# EasyEDA Pro project LM2596S_V1.0.eprj

# Board 1-PCB_降压LM2596S.PcbDoc
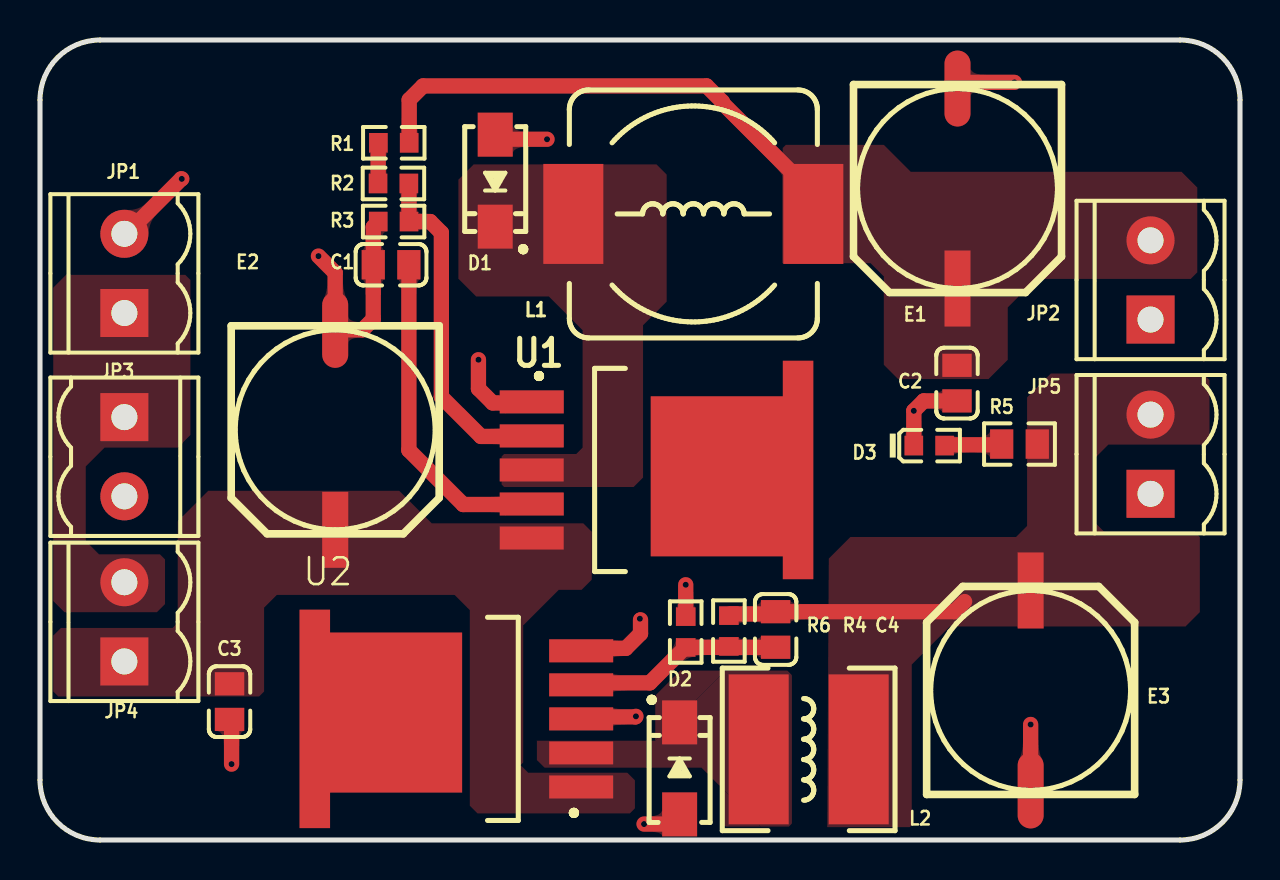
[diagram p0: board, top side]
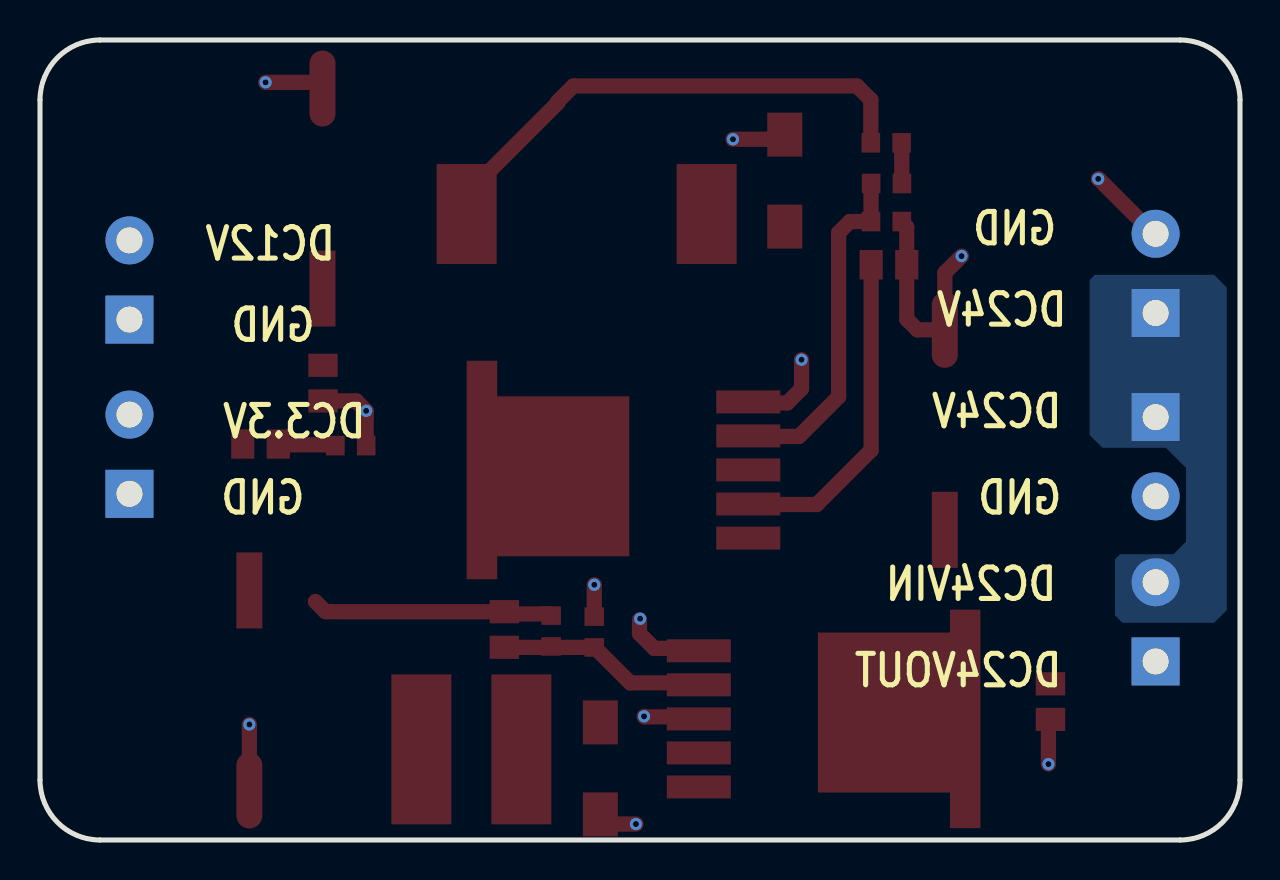
[diagram p1: board, bottom side, seen from below]

Outline 60 x 40 mm; copper layers: Top Layer, Bottom Layer. Coordinates in mm from the lower left corner of the outline.
Outline path: 0,37 arc(0.88,39.12) 3,40 57,40 arc(59.12,39.12) 60,37 60,3 arc(59.12,0.88) 57,0 3,0 arc(0.88,0.88) 0,3 0,37
Stack: Top Layer 0.035mm / Dielectric1 1.51mm FR4 er 4.5 / Bottom Layer 0.035mm

## Design rules (mm)
spacing Default (default): track to track 0.152, other pairs 0 to 0.152
track width Default (default): min 0.152, default 0.152, max 25.4
differential pair differentialPair (default): width min 0.127, default 0.254, max 2.54; gap min 0.152, default 0.152
via Default (default): diameter min 0.61, default 0.61, max 100.025; hole min 0.305, default 0.305, max 59.995
net GND uses (1)

## Placement (name value [footprint] x y rotation side)
C1  1uF (105) 10% 50V  [0805_C]  17.55 28.76 0 top
C2  100nF(104) 10% 50V  [0805_C]  45.85 22.84 270 top
C3  100nF(104) 10% 50V  [0805_C]  9.48 6.92 270 top
C4  100nF(104) 10% 50V  [0805_C]  36.78 10.53 270 top
D1  SS54  [SMA]  22.76 32.97 270 top
D2  SS54  [SMA]  31.98 3.58 90 top
D3  红灯 0603  [0603_LED_S1]  44.46 19.72 0 top
E1  220UF/16V  [CT 10*8 - V]  45.88 32.57 270 top
E2  220UF/16V  [CT 10*8 - V]  14.76 20.51 270 top
E3  220UF/16V  [CT 10*8 - V]  49.53 7.48 90 top
JP1  HDR-1X2  [HT3.96-LI-2P]  4.22 28.33 90 top
JP2  HDR-1X2  [HT3.96-LI-2P]  55.53 28 90 top
JP3  HDR-1X2  [HT3.96-LI-2P]  4.22 19.16 270 top
JP4  HDR-1X2  [HT3.96-LI-2P]  4.22 10.91 90 top
JP5  HDR-1X2  [HT3.96-LI-2P]  55.53 19.29 90 top
L1  47UH  [CDRH129]  32.67 31.3 0 top
L2  33UH  [CD73]  38.43 4.53 0 top
R1  90KΩ  [0603_R]  17.69 34.86 0 top
R2  0Ω (0R0) ±1%  [0603_R]  17.67 32.83 180 top
R3  10KΩ (1002) ±1%  [0603_R]  17.68 30.92 0 top
R4  18KΩ (1802) ±1%  [0603_R]  34.44 10.45 90 top
R5  10KΩ (1002) ±1%  [0805_R]  48.97 19.8 0 top
R6  10KΩ (1002) ±1%  [0603_R]  32.29 10.4 270 top
U1  XL4015E1  [TO-263-5_L10.2-W8.9-P1.70-TL]  29.59 18.5 0 top
U2  LM2596S-ADJ  [TO-263-5_L10.2-W8.9-P1.70-TL]  22.05 6.06 180 top

## Footprints (pads in the part's own frame, mm; a bottom-side part is the same pattern mirrored in y, then rotated)
0603_LED_S1
  rect 0.93x0.98 smd: A(0.77,0) K(-0.77,0)
0603_R
  rect 0.93x0.98 smd: 1(-0.77,0) 2(0.77,0)
0805_C
  rect 1.16x1.47 smd: 1(-0.89,0) 2(0.89,0)
0805_R
  rect 1.16x1.47 smd: 1(-0.89,0) 2(0.89,0)
CD73
  rect 3x7.5 smd: 1(-2.5,0) 2(2.5,0)
CDRH129
  rect 3x5 smd: 1(-6,0) 2(6,0)
CT 10*8 - V
  rect 3.8x1.3 smd: 1(5,0)
  oval 3.8x1.3 smd: 2(-5,0)
HT3.96-LI-2P
  rect 2.4x2.4 hole 1.3: 1(-1.98,0)
  round 2.4 hole 1.3: 2(1.98,0)
SMA
  rect 2.2x1.75 smd: 1(-2.3,0) 2(2.3,0)
TO-263-5_L10.2-W8.9-P1.70-TL
  rect 3.2x1.15 smd: 1(-5.008,3.404) 2(-5.008,1.702) 3(-5.008,0) 4(-5.008,-1.702) 5(-5.008,-3.404)

## Nets
GND: C1.1 C2.2 C3.2 D1.1 D2.1 D3.K E1.2 E2.2 E3.2 JP1.2 JP2.1 JP3.2 JP5.1 R3.1 R6.1 U1.1 U2.3 U2.5
FB: R2.1 R3.2 U1.2
NETC1_2: C1.2 U1.4
NETC2_1: C2.1 E1.1 JP2.2 L1.2 R1.2
NETC3_1: C3.1 E2.1 JP4.1 U1.5 U2.1
NETC4_1: C4.1 E3.1 JP5.2 L2.2 R4.2 R5.2
NETC4_2: C4.2 R4.1 R6.2 U2.4
NETD1_2: D1.2 L1.1 U1.3
NETD2_2: D2.2 L2.1 U2.2
NETD3_A: D3.A R5.1
NETJP1_1: JP1.1 JP3.1 JP4.2
NETR1_1: R1.1 R2.2

## Via types
v1: diameter 0.61, hole 0.305, Top Layer to Bottom Layer, 12 vias

## Routing (per net, layer and track width the routed paths; a pad name or vN(x,y) marks a point on that pad's centre or on a via; arc(x,y) is an arc through that point)
GND: length 46.2
  Top Layer w0.762: D1.1 22.99,35.04 v1(25.35,35.04) ; C2.2 44.19,21.95 v1(43.69,21.46) D3.K ; 26.7,6.16 29.77,6.16 v1(29.8,6.18) ; 30.03,11.01 30.03,10.32 29.29,9.58 26.72,9.58 26.7,9.56 ; v1(7.09,33.06) 7.06,33.06 4.32,30.31 JP1.2 ; v1(30.2,0.8) 31.5,0.8 D2.1 ; R3.1 16.91,30.9 16.66,30.65 C1.1 16.66,26.04 16.13,25.51 E2.2 14.76,28.36 v1(13.92,29.19) ; E1.2 45.88,37.63 46.12,37.88 v1(48.72,37.88) ; v1(21.92,24.01) 21.92,22.57 22.63,21.85 24.84,21.85 24.87,21.88 ; C3.2 9.58,5.93 v1(9.58,3.79) ; E3.2 v1(49.53,5.78) ; R6.1 v1(32.29,12.76)
  vias: v1(29.99,11.06)
FB: length 17.6
  Top Layer w0.762: R2.1 18.45,32.82 18.45,30.93 R3.2 19.51,30.92 20.07,30.36 20.07,22.16 22.05,20.18 24.87,20.18
NETC1_2: length 16.8
  Top Layer w0.762: C1.2 18.44,19.49 21.16,16.77 24.87,16.77
NETC2_1: length 26
  Top Layer w0.762: 18.43,34.89 R1.2 18.46,37.01 19.15,37.7 33.33,37.7 34.12,36.92 34.12,36.85 38.67,32.3 L1.2
NETC4_1: length 12.1
  Top Layer w0.762: 46.23,11.92 45.72,11.42 C4.1 36.67,11.3 34.53,11.3 R4.2
NETC4_2: length 10.8
  Top Layer w0.762: 26.7,7.86 30.49,7.86 32.26,9.63 32.29,9.63 32.29,9.63 36.78,9.63 C4.2
NETD3_A: length 2.9
  Top Layer w0.762: 48.08,19.8 48.05,19.76 45.27,19.76 D3.A
NETR1_1: length 2
  Top Layer w0.762: R2.2 16.91,32.83 16.91,34.85 R1.1

## Copper pours and planes (outline as drawn; the poured copper is in the pictures)
GND on Top Layer: 48.93,5.01 50.13,5.01 50.13,3.98 48.93,3.98
GND on Top Layer: 14.16,28.04 15.36,28.04 15.36,27.01 14.16,27.01
GND on Top Layer: 15.41,26.23 16.13,26.23 16.13,24.79 15.41,24.79
GND on Top Layer: 23.63,35.8 24.4,35.8 24.4,34.27 23.63,34.27
GND on Top Layer: 8.82,5.45 10.21,5.45 10.21,4.69 8.82,4.69
GND on Top Layer: 4.3,31.86 5.83,31.86 5.83,30.25 4.3,30.25
GND on Top Layer: 46.52,38.64 47.29,38.64 47.29,37.12 46.52,37.12
GND on Top Layer: 30.35,1.56 31.11,1.56 31.11,0.18 30.35,0.18
GND on Bottom Layer: -3.15,41.84 61.88,41.84 61.88,-2.61 -3.15,-2.61
NETC2_1 on Top Layer: 36.63,34.34 38.25,34.34 38.25,32.72 36.63,32.72
NETC2_1 on Top Layer: 37.11,34.76 57.86,34.76 57.86,23.05 37.11,23.05
NETC3_1 on Top Layer: 0.66,17.46 29.75,17.46 29.75,1.33 0.66,1.33
NETC4_1 on Top Layer: 39.36,23.33 58.47,23.33 58.47,0.64 39.36,0.64
NETC4_2 on Top Layer: 31.26,10.09 32.77,10.09 32.77,8.63 31.26,8.63
NETD1_2 on Top Layer: 20.92,33.78 31.33,33.78 31.33,17.65 20.92,17.65
NETD2_2 on Top Layer: 33.99,2.7 36.02,2.7 36.02,0.67 33.99,0.67
NETD2_2 on Top Layer: 24.84,8.47 37.59,8.47 37.59,0.67 24.84,0.67
NETD2_2 on Top Layer: 30.76,8.47 34.27,8.47 34.27,4.96 30.76,4.96
NETD3_A on Top Layer: 46.75,20.52 47.51,20.52 47.51,19.06 46.75,19.06
NETJP1_1 on Top Layer: 0.66,28.25 7.52,28.25 7.52,11.39 0.66,11.39
NETJP1_1 on Bottom Layer: 0.66,28.25 7.52,28.25 7.52,10.86 0.66,10.86

Small or netless copper shapes (teardrops, artwork), in the pictures only: 27 on Top Layer

## Text on the board
Bottom Silkscreen Layer: DC24V | GND | DC24VOUT | DC24VIN | DC3.3V | DC12V
